# Altium project GateWay.PrjPcb
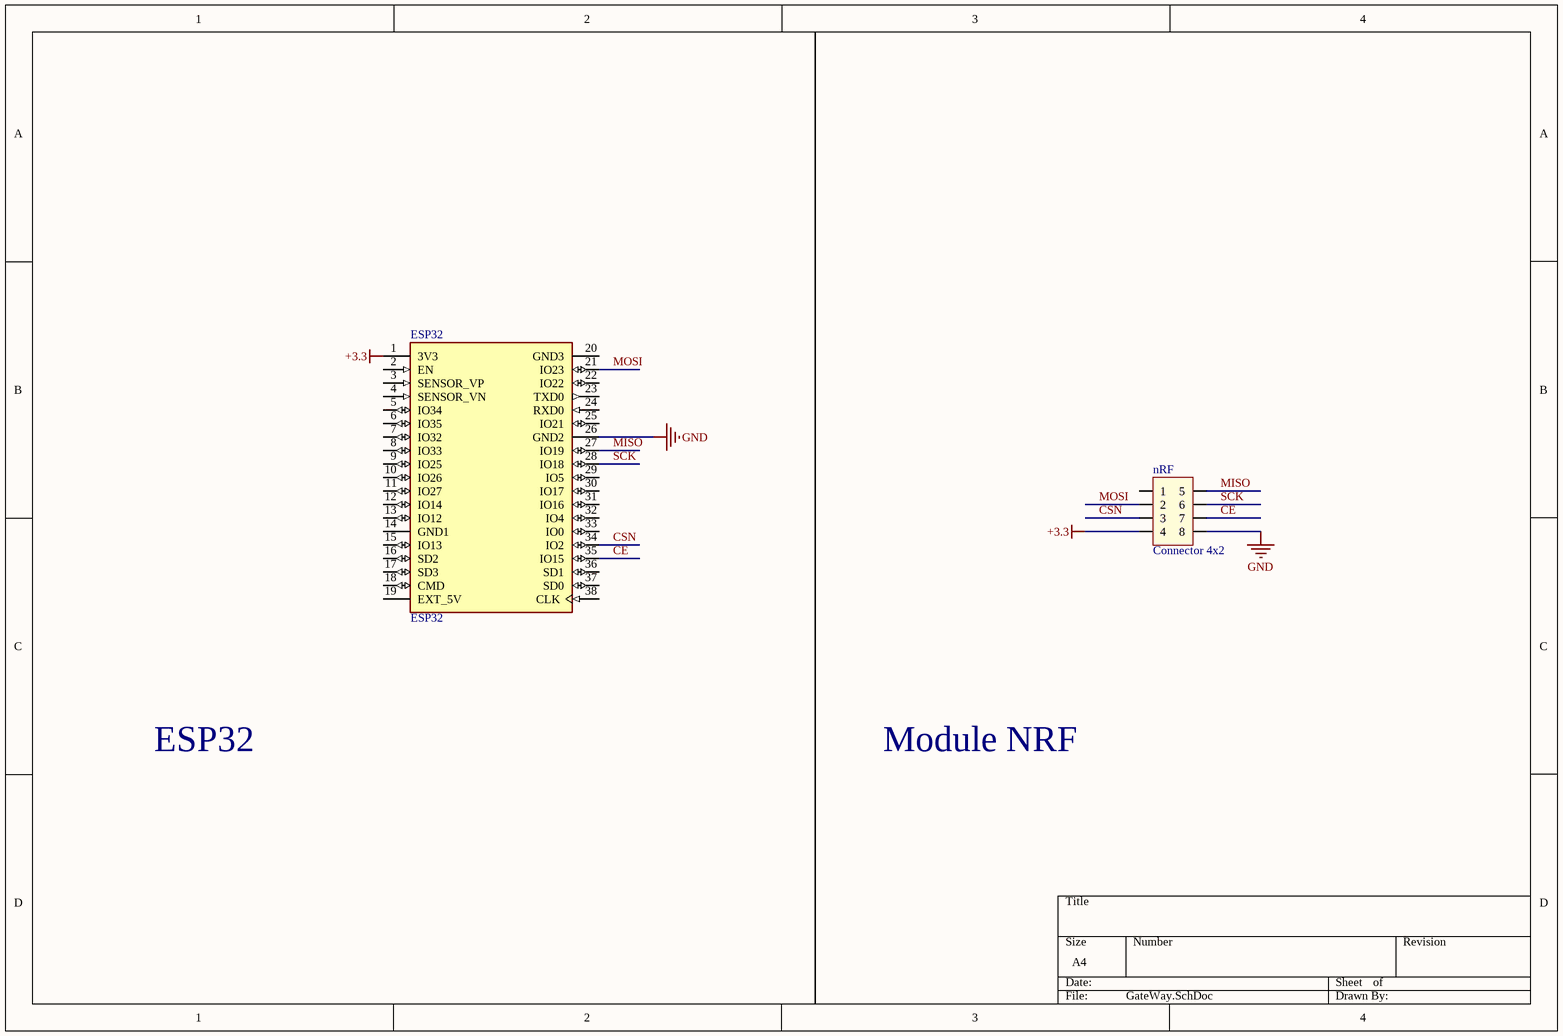
[diagram p0: GateWay.SchDoc]
1 sheet, 2 parts. Net scope: global (net labels, ports and power ports of the same name join across sheets).
Board file: GateWay.PcbDoc

## Sheet GateWay.SchDoc
size A4

### Parts
ESP32  ESP32  [MODULE_ESP32-DEVKITC-32D]
nRF  Connector 4x2  [JP4x2]

### Nets
+3.3: ESP32.1(3V3) nRF.4
GND: ESP32.26(GND2) nRF.8
CE: ESP32.35(IO15) nRF.7
CSN: ESP32.34(IO2) nRF.3
MISO: ESP32.27(IO19) nRF.5
MOSI: ESP32.21(IO23) nRF.2
SCK: ESP32.28(IO18) nRF.6

Not connected (* = marked no-connect by the designer): ESP32 2(EN) 3(SENSOR_VP) 4(SENSOR_VN) 5(IO34) 6(IO35) 7(IO32) 8(IO33) 9(IO25) 10(IO26) 11(IO27) 12(IO14) 13(IO12) 14(GND1) 15(IO13) 16(SD2) 17(SD3) 18(CMD) 19(EXT_5V) 20(GND3) 22(IO22) 23(TXD0) 24(RXD0) 25(IO21) 29(IO5) 30(IO17) 31(IO16) 32(IO4) 33(IO0) 36(SD1) 37(SD0) 38(CLK); nRF 1

### Notes on the sheet
- ESP32
- Module NRF

### Library data of the parts
ESP32 = ESP32-DEVKITC-32D: EVAL BOARD FOR ESP-WROOM-32; MF: Espressif Systems; Value: *; MP: ESP32-DEVKITC-32D; Price: None; Check_prices: https://www.snapeda.com/parts/ESP32-DEVKITC-32D/Espressif%20Systems/view-part/2777395/?ref=eda; SnapEDA_Link: https://www.snapeda.com/parts/ESP32-DEVKITC-32D/Espressif%20Systems/view-part/2777395/?ref=snap; Availability: Warning; Purchase-URL: https://pricing.snapeda.com/search/part/ESP32-DEVKITC-32D/?ref=eda; Package: None
nRF = JP4x2: Value: Connector 4x2